# Altium schematic sheet SRD-05VDC-SL-C1_SRD-05VDC-SL-C.schdoc
size 127 x 99 mm
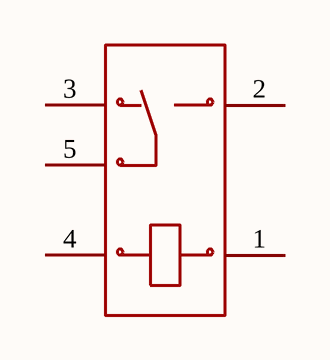
[diagram p0: SRD-05VDC-SL-C1_SRD-05VDC-SL-C.schdoc]

## Parts
RLY?  SRD-05VDC-SL-C  [RELAY-TH_SRD-XXVDC-XL-C]  (value not drawn)

## Nets

Not connected (* = marked no-connect by the designer): RLY? 1 2 3 4 5

## Library data of the parts
RLY? = SRD-05VDC-SL-C: Manufacturer: 松乐; Add into BOM: yes; Coil Voltage: 5V; Contact Form: 一组转换:1C(单刀双掷-转换); Pin Number: 5; Maximum Switching Voltage: 250V@AC; Coil Rated Power: 360mW; Maximum Switching Current: 15A; Coil Type: 无极性-单线圈; Coil Resistance: 70Ω; Contact Resistance: 100mΩ; Operate Time: 10ms; Symbol: SRD-05VDC-SL-C; Device: SRD-05VDC-SL-C; LCSC Part Name: 蓝色; Supplier Part: C35449; Manufacturer Part: SRD-05VDC-SL-C; Supplier Footprint: 插件,15.6x19.2mm; JLCPCB Part Class: Extended Part; Datasheet: https://atta.szlcsc.com/upload/public/pdf/source/20200305/C490149_C96E4098A3B1FFB377D5AD2E40B7C2A8.pdf; Supplier: LCSC; Convert to PCB: yes; Contact Rating: -; Release Time: 10ms